# EAGLE design CapacitiveSensorBreakout-v1.0 (EAGLE 9.6.2)
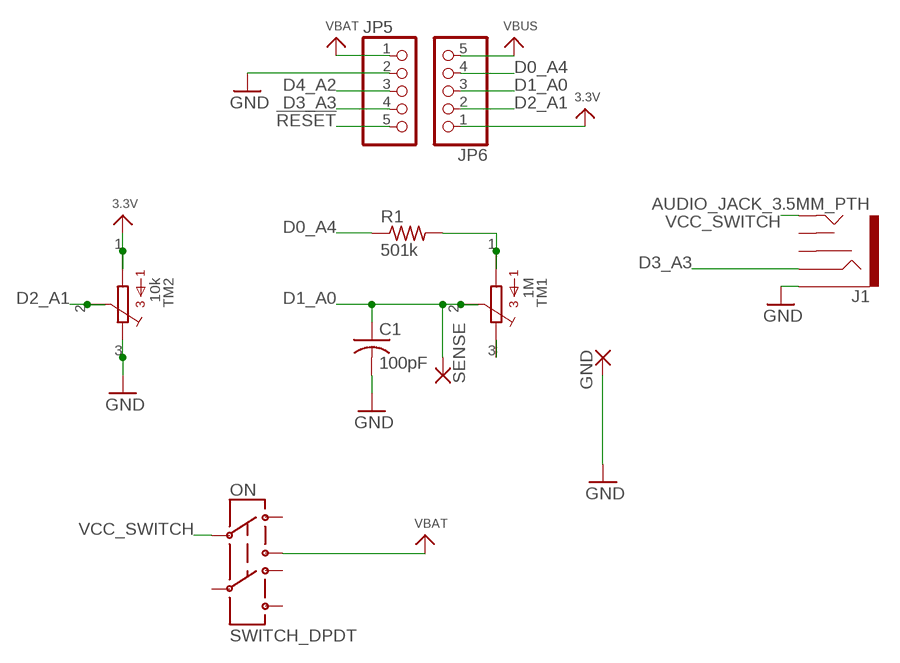
[diagram p0: schematic, sheet 1]

## Parts
C1  100pF  C-USC0603  [C0603]
GND  1,6/0,8  [1,6/0,8]
J1  AUDIO_JACK_3.5MM_PTH  [AUDIO-JACK]
JP5  HEADER-1X576MIL  [1X05_ROUND_76]
JP6  HEADER-1X576MIL  [1X05_ROUND_76]
ON  SWITCH_DPDT  [JS_DPDT_TH]
R1  501k  R-US_R0603  [R0603]
SENSE  1,6/0,8  [1,6/0,8]
TM1  1M  3386  [3386-MULTI]
TM2  10k  3386  [3386-MULTI]

## Nets
3.3V: JP6.1 TM2.1 TM2.4
!RESET: JP5.5
D0_A4: JP6.4 R1.1
D1_A0: C1.1 JP6.3 SENSE.1(P) TM1.2 TM1.5
D2_A1: JP6.2 TM2.2 TM2.5
D3_A3: J1.RING JP5.4
D4_A2: JP5.3
GND: C1.2 GND.1(P) J1.SLEEVE JP5.2 TM2.3 TM2.6
N$1: TM1.3 TM1.6
N$3: R1.2 TM1.1 TM1.4
VBAT: JP5.1 ON.3
VBUS: JP6.5
VCC_SWITCH: J1.TIP ON.2
Unconnected: J1.RSH J1.TSH ON.1 ON.4 ON.5 ON.6

## Library data of the parts
C1 = rcl:C-US: CAPACITOR, American symbol; SPICEPREFIX: C
GND SENSE = wirepad:1,6/0,8: THROUGH-HOLE PAD
J1 = SparkFun-Connectors:AUDIO_JACK_3.5MM: Audio Jack 3.5mm variants of PTH and SMT stereo audio jack with bypass switches. SparkFun Products: SparkFun SparkPunk Sound Kit <[https://www.sparkfun.com/products/11177]> - PTH MP3 Trigger <https://www.sparkfun.com/products/13720> -3.5mm SMD SparkFun PicoBoard <https://www.sparkfun.com/products/11888>- 2.5mm SMD; PROD_ID: CONN-08774; SF_ID: PRT-08032
JP5 JP6 = microbuilder:HEADER-1X5: PIN HEADER
ON = ELEC327:SWITCH_DPDT
R1 = rcl:R-US_: RESISTOR, American symbol; SPICEPREFIX: R
TM1 TM2 = bourns:3386: 3386 Series 3/8" Square Trimmer (Multi-Package F,P,K & Y)

## Net classes
0 default: clearance 0.205 mm

## Board
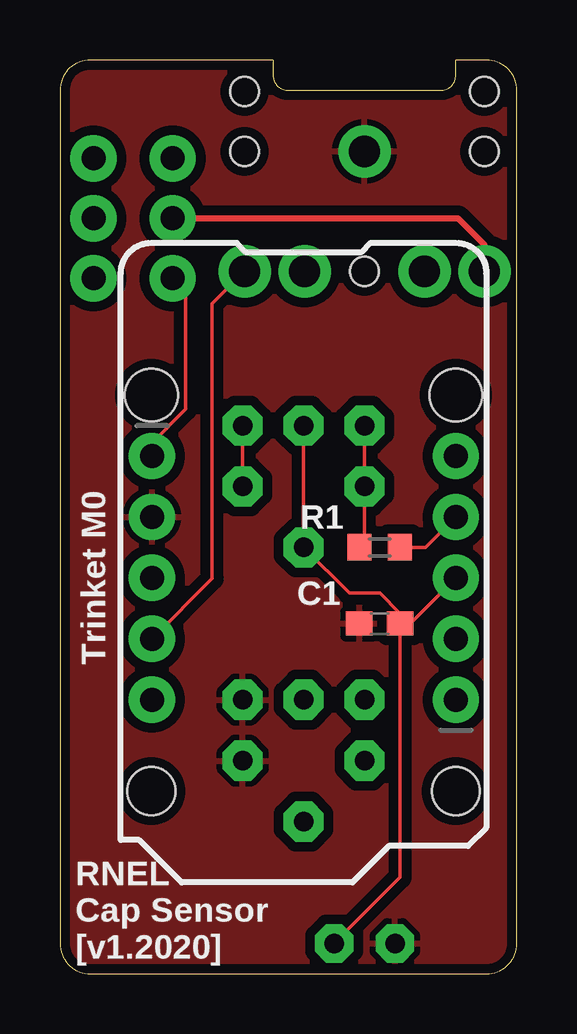
[diagram p1: board, top side]
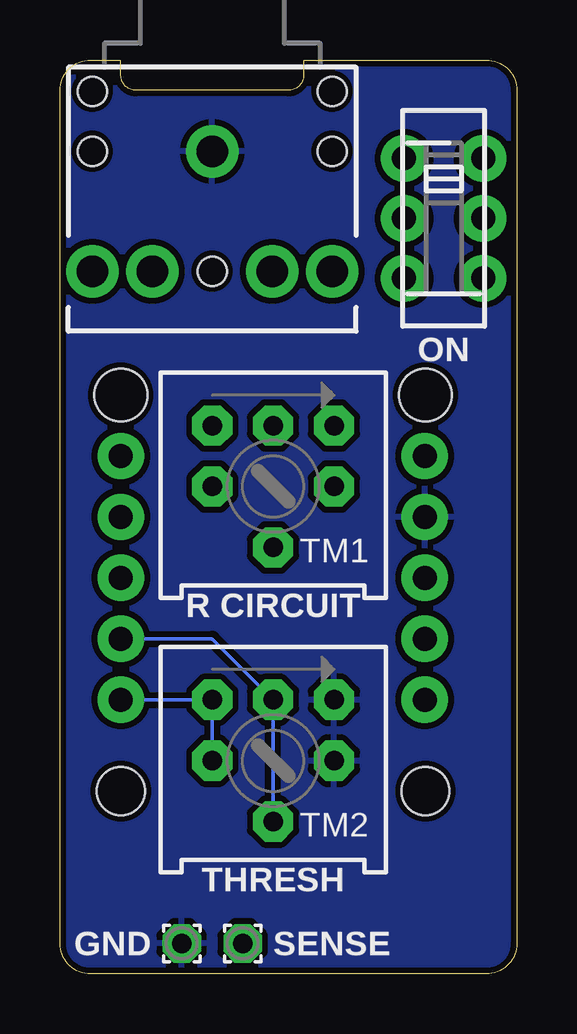
[diagram p2: board, bottom side, seen from below]

Size 19.05 x 38.1 mm. Coordinates in mm from the lower left corner, seen from the top.
Outline: 19.05,1.27 19.05,36.83 arc90 17.78,38.1 16.51,38.1 16.51,37.47 arc-90 15.88,36.83 9.53,36.83 arc-90 8.89,37.47 8.89,38.1 1.27,38.1 arc90 0,36.83 0,1.27 arc90 1.27,0 17.78,0 arc90 19.05,1.27
Copper layers (1*16): Top 0.035mm / dielectric 1.5mm / Bottom 0.035mm
Design rules "default *": minimum track width 6mil, minimum drill 0.35mm, track to track 6mil, track to pad 6mil, pad to pad 6mil, via to via 6mil, smd to smd 6mil, copper to edge 10mil, drill to drill 6mil, minimum pad ring 10mil, minimum via ring 8mil, stop-mask expansion 4mil, vias tented up to drill 0mil, thermal gap 10mil
Holes 2.2 mm at 3.81,24.13 16.51,24.13
Holes 2 mm at 16.51,7.62 3.81,7.62

### Footprints (pad centres in the part's own frame; a part is rotated, then mirrored left to right if it is on the bottom)
C0603 = smd 1.1 x 1: 1 -0.85,0; 2 0.85,0
1,6/0,8 = drill 0.813 pad 1.6 octagon: 1 0,0
AUDIO-JACK = drill 1.3 pad 2.184: RING 5,5; RSH 5,2.5; SLEEVE 0,0; TIP 5,-5; TSH 5,-2.5 | hole 1.2: 0,5; -2.5,5; -2.5,-5; 0,-5; 5,0
1X05_ROUND_76 = drill 1 pad 1.93: 1 -5.08,0; 2 -2.54,0; 3 0,0; 4 2.54,0; 5 5.08,0
JS_DPDT_TH = drill 1 pad 1.93: 1 -2.5,-1.65; 2 0,-1.65; 3 2.5,-1.65; 4 -2.5,1.65; 5 0,1.65; 6 2.5,1.65
R0603 = smd 1 x 1.1: 1 -0.85,0; 2 0.85,0
3386-MULTI = drill 0.813 pad 1.676 octagon: 1 -2.54,0; 2 0,-2.54; 3 2.54,0; 4 -2.54,2.54; 5 0,2.54; 6 2.54,2.54

### Placement (x,y rotation side)
C1  13.34,14.61 180 top
GND  13.97,1.27 0 bottom
J1  12.7,34.29 270 bottom
JP5  3.84,16.51 270 top
JP6  16.51,16.51 90 top
ON  3.05,31.5 270 bottom
R1  13.34,17.78 180 top
SENSE  11.43,1.27 180 bottom
TM1  10.16,20.32 0 bottom
TM2  10.16,8.89 0 bottom

### Tracks (layer width: path | path; a pad name or v marks a point on that pad's centre or on a via)
3.3V
  Bottom 0.152: JP6.1 TM2.4 TM2.1
D0_A4
  Top 0.152: JP6.4 15.24,17.78 R1.1
D1_A0
  Top 0.152: C1.1 14.19,15.03 13.34,15.88 12.06,15.88 TM1.2 TM1.5 | JP6.3 14.61,14.61 C1.1 | C1.1 14.19,4.03 SENSE.1
D2_A1
  Bottom 0.152: JP6.2 12.7,13.97 TM2.5 TM2.2
D3_A3
  Top 0.152: JP5.4 6.35,16.48 6.35,27.94 J1.RING
GND
  pour Top (isolate 0.406): 0,0 0,38.1 19.05,38.1 19.05,0
  pour Bottom (isolate 0.254): 0,0 0,38.1 19.05,38.1 19.05,0
N$1
  Top 0.152: TM1.3 TM1.6
N$3
  Top 0.152: R1.2 12.7,18 TM1.1 TM1.4
VBAT
  Top 0.152: JP5.1 3.83,22.13 5.24,23.54 5.24,28.45 ON.3
VCC_SWITCH
  Top 0.254: J1.TIP 17.7,30.4 16.6,31.5 ON.2

### Text on the board
tPlace: Trinket M0 | RNEL / Cap Sensor / [v1.2020]
bPlace: R CIRCUIT | THRESH